# Altium project SDR_cubesat.PrjPcb (part 2 of 2)

## Sheet burnwire.SchDoc
size A; SheetNumber: 8; SheetTotal: 10
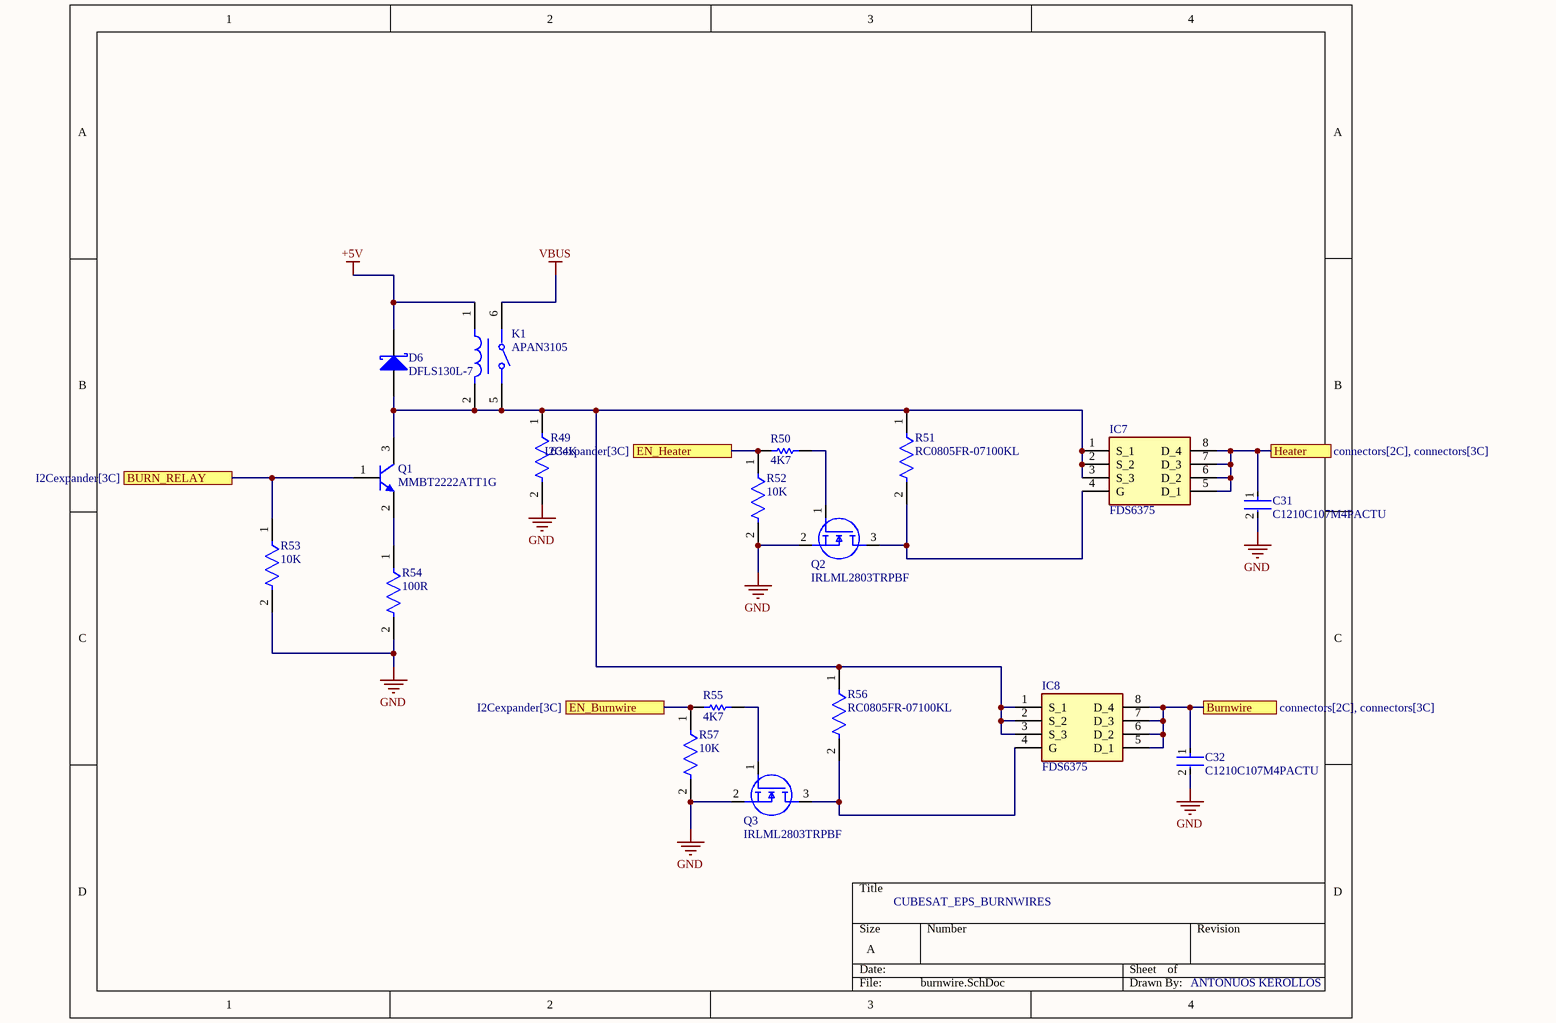
[diagram p7: burnwire.SchDoc]

### Parts
C31  C1210C107M4PACTU  [FP-C1210C-FS-MFG]
C32  C1210C107M4PACTU  [FP-C1210C-FS-MFG]
D6  DFLS130L-7  [DIOD-POWERDI123-2_A_V]
IC7  FDS6375  [SOIC127P600X175-8N]
IC8  FDS6375  [SOIC127P600X175-8N]
K1  APAN3105  [FP-APAN3105-MFG]
Q1  MMBT2222ATT1G  [ONSC-SC-75-3-463-01_V]
Q2  IRLML2803TRPBF  [SOT95P237X112-3N]
Q3  IRLML2803TRPBF  [SOT95P237X112-3N]
R49  634K  [FP-CRCW0805-e3-IPC_A]
R50  4K7  [YAGO-RC0805_M]
R51  RC0805FR-07100KL  [FP-RC0805-0_6-IPC_C]
R52  10K  [FP-CRCW0805-e3-IPC_A]
R53  10K  [FP-CRCW0805-e3-IPC_A]
R54  100R  [FP-RC0603-0_55-MFG]
R55  4K7  [YAGO-RC0805_M]
R56  RC0805FR-07100KL  [FP-RC0805-0_6-IPC_C]
R57  10K  [FP-CRCW0805-e3-IPC_A]

### Ports
BURN_RELAY (see I2Cexpander[3C]), Burnwire (see connectors[2C], connectors[3C]), EN_Burnwire (see I2Cexpander[3C]), EN_Heater (see I2Cexpander[3C]), Heater (see connectors[2C], connectors[3C])

### Nets
+5V: D6.2(K) K1.1
GND: C31.2 C32.2 Q2.2(S) Q3.2(S) R49.2 R52.2 R53.2 R54.2 R57.2
VBUS: K1.6(COM)
NetC31_1: C31.1 IC7.5(D_1) IC7.6(D_2) IC7.7(D_3) IC7.8(D_4) ; port Heater
NetC32_1: C32.1 IC8.5(D_1) IC8.6(D_2) IC8.7(D_3) IC8.8(D_4) ; port Burnwire
NetD6_1: D6.1(A) IC7.1(S_1) IC7.2(S_2) IC7.3(S_3) IC8.1(S_1) IC8.2(S_2) IC8.3(S_3) K1.2 K1.5(NO) Q1.3(C) R49.1 R51.1 R56.1
NetIC2_7: Q1.1(B) R53.1 ; port BURN_RELAY
NetIC2_8: R50.1 R52.1 ; port EN_Heater
NetIC2_10: R55.1 R57.1 ; port EN_Burnwire
NetIC7_4: IC7.4(G) Q2.3(D) R51.2
NetIC8_4: IC8.4(G) Q3.3(D) R56.2
NetQ1_2: Q1.2(E) R54.1
NetQ2_1: Q2.1(G) R50.2
NetQ3_1: Q3.1(G) R55.2

### Notes on the sheet
- CUBESAT_EPS_BURNWIRES
- ANTONUOS KEROLLOS

### Library data of the parts
C31 C32 = CMP-03020-034653-1: CAP CER 100UF 16V X5R 1210; Tolerance: 20%; Dielectric Material: Ceramic; Max Operating Temperature: 85°C; REACH SVHC: No SVHC; Case Code (Metric): 3225; Case/Package: 1210; Thickness: 0.106inch; Length: 3.2mm; Min Operating Temperature: -55°C; Voltage Rating (DC): 16V; Weight: 0.000564oz; Packaging: Tape and Reel; Case Code (Imperial): 1210; Depth: 2.5mm; Lead Free: Lead Free; Width: 0.098inch; Voltage Rating: 16V; Capacitance: 100uF; Termination: SMD/SMT; Dielectric: X5R; Package Quantity: 1000
D6 = CMP-2000-07448-1: Schottky Barrier Rectifier, 30 V, 1 A, -40 to 125 degC, 2-Pin SMD, RoHS, Tape and Reel; Manufacturer: Diodes Inc; Max Repetitive Reverse Voltage (Vrrm): 30V; Polarity: Standard; Average Rectified Current: 1A; Element Configuration: Single; Forward Voltage: 360mV; Peak Non-Repetitive Surge Current: 50A; Max Power Dissipation: 1.67W; Case\/Package: SMD/SMT; Capacitance: 76pF; Peak Reverse Current: 1mA; Datasheet URL: https://www.diodes.com/assets/Datasheets/ds30492.pdf; Package Quantity: 3000; Reverse Voltage (DC): 30V; Package Reference: POWERDI123-2_A; Lead Free: LeadFree; Mounting Technology: SurfaceMount; Max Operating Temperature: 125degC; Current Rating: 1A; Radiation Hardening: No; Width: 1.78mm; Height: 0.98mm; Output Current: 1A; Contact Plating: Matte; Length: 2.8mm; Number of Pins: 2; Voltage Rating (DC): 30V; RoHSCompliant: true; Termination: SMD/SMT; Forward Current: 1A; Min Operating Temperature: -40degC; Datasheet Version: Rev. 4-2, 06/2009; Packaging: TapeandReel; REACH SVHC: NoSVHC; Max Forward Surge Current (Ifsm): 50A; Manufacturer URL: http://www.diodes.com/; Mount: SurfaceMount; Package Description: 2-Pin Small Outline Diode, Body 2.8 x 1.78 mm
IC7 IC8 = FDS6375: Integrated Circuit; Manufacturer_Name: onsemi; Datasheet Link: https://www.onsemi.com/pub/Collateral/FDS6375-D.pdf; Height: 1.75mm; Manufacturer_Part_Number: FDS6375; Mouser Part Number: 512-FDS6375; Mouser Price/Stock: https://www.mouser.co.uk/ProductDetail/onsemi-Fairchild/FDS6375?qs=HK%252BeIG1iaag0XY66%2FG8lnA%3D%3D; Arrow Part Number: FDS6375; Arrow Price/Stock: https://www.arrow.com/en/products/fds6375/on-semiconductor
K1 = CMP-05606-000084-1: RELAY GENERAL PURPOSE SPST 5A 5V; Coil Power: 110mW; Coil Type: Non-Latching; Coil Resistance: 227R; Coil Current: 22mA; Release Time: 5ms; Operate Time: 10ms; Contact Material: Gold; Termination: PC Pin; Contact Current Rating: 5A; Throw Configuration: SPST; Package Quantity: 25; Coil Voltage (DC): 5V; Lead Free: Lead Free; Mount: Through Hole; Min Operating Temperature: -40°C; Max Operating Temperature: 90°C; Packaging: Rail/Tube; RoHS Compliant: Yes; Relay Type: General Purpose
Q1 = CMP-1048-00417-1: General Purpose Transistor, NPN Silicon, 3-Pin SC-75, Pb-Free, Tape and Reel; Manufacturer: On Semiconductor; IC Continuous (A): 0.6; fT Min (MHz): 300; DatasheetVersion: Rev. 5; PackageVersion: Rev. F, 07/2005; ComponentLink1Description: Manufacturer URL; RoHS: TRUE; Packing: Tape and Reel; ComponentLink3URL: http://www.onsemi.com/pub_link/Collateral/463-01.PDF; ComponentLink1URL: http://www.onsemi.com/; ComponentLink3Description: Package Specification; ComponentLink2URL: http://www.onsemi.cn/pub_link/Collateral/MMBT2222ATT1-D.PDF; Mounting Technology: Surface Mount; PartNumber: MMBT2222ATT1G; ComponentLink2Description: Datasheet; Polarity: NPN; PackageReference: SC-75-3-463-01; PackageDescription: 3-Pin Small Outline Transistor, Body 1.6 x 0.8 mm, Pitch 0.5 mm
Q2 Q3 = IRLML2803TRPBF: MOSFET (N-Channel); Manufacturer_Name: Infineon; Datasheet Link: https://www.infineon.com/dgdl/irlml2803pbf.pdf?fileId=5546d462533600a4015356682aff260f; Height: 1.12mm; Manufacturer_Part_Number: IRLML2803TRPBF; Mouser Part Number: 942-IRLML2803TRPBF; Mouser Price/Stock: https://www.mouser.co.uk/ProductDetail/Infineon-Technologies/IRLML2803TRPBF?qs=9%252BKlkBgLFf2YYGlrpx3%252BKw%3D%3D; Arrow Part Number: IRLML2803TRPBF; Arrow Price/Stock: https://www.arrow.com/en/products/irlml2803trpbf/infineon-technologies-ag?utm_currency=USD&region=nac
R49 = CMP-1013-00827-2: RES Thick Film, 634kΩ, 1%, 0.125W, 100ppm/°C, 0805; Voltage Rating: 150V; Max Power Dissipation: 125mW; Resistance: 634kR; Weight: 0.000194oz; Max Operating Temperature: 155°C; Case Code (Metric): 2012; Height: 0.02inch; Temperature Coefficient: 100ppm/°C; Power Rating: 125mW; Length: 2mm; Contact Plating: Tin; Package Quantity: 10; Packaging: Tape and Reel; Min Operating Temperature: -55°C; Case Code (Imperial): 0805; Termination: SMD/SMT; Composition: Thick Film; Case/Package: 0805; Lead Free: Lead Free; Voltage Rating (DC): 150V; Width: 0.049inch; Features: Automotive AEC-Q200; Tolerance: 1%; Radiation Hardening: No; Depth: 1.25mm; Military Standard: Not; Number of Terminations: 2
R50 R55 = CMP-1568-00001-1: General Puprose Chip Resistor, 4700 Ohm +/- 1%, 0.125 W, -55 to 155 degC, 2-Pin SMD, RoHS, Tape and Reel; PartNumber: RC0805FR-074K7L; Tolerance: +/- 1%; Power: 0.125 W; PackageDescription: 2-Pin Surface Mount Device, Body 2 x 1.25 mm; ComponentLink2URL: http://www.yageo.com/documents/recent/PYu-RC_Group_51_RoHS_L-3.pdf; Temperature Min: -55 degC; Packing: Tape and Reel; Mounting Technology: Surface Mount; ComponentLink1URL: http://www.yageo.com/NewPortal/_en/index.jsp; Resistance: 4700 Ohm; Temperature Max: 155 degC; ComponentLink2Description: Datasheet; DatasheetVersion: Rev. 3; RoHS: TRUE; ComponentLink1Description: Manufacturer URL
R51 R56 = CMP-2100-03668-5: RES 100K OHM 1% 1/8W 0805; Power Rating: 125mW; Temperature Coefficient: 100ppm/°C; Voltage Rating (DC): 150V; Resistance: 100kR; Package Quantity: 1; Case/Package: 0805; Lead Pitch: 0.4mm; Case Code (Imperial): 0805; Construction: Rectangular; Number of Terminations: 2; RoHS Compliant: Yes; Max Power Dissipation: 125mW; Tolerance: 1%; Max Operating Temperature: 155°C; Resistance Tolerance: 1%; Lead Free: Lead Free; Packaging: Tape and Reel; Resistor Type: Thick Film; Min Operating Temperature: -55°C; Case Code (Metric): 2012; Series: RC; Technology: THICK FILM; Voltage Rating: 150V; Termination: SMD/SMT; Width: 0.049inch; Number of Pins: 2; Features: Moisture Resistant; Military Standard: Not; Length: 0.079inch; Depth: 1.25mm; Size Code: 0805; Height: 0.024inch
R52 R53 R57 = CMP-2001-04908-2: RES Thick Film, 10kΩ, 1%, 0.125W, 100ppm/°C, 0805; Resistance: 10kR; Voltage Rating (DC): 150V; Power Rating: 125mW; Weight: 0.000194oz; Package Quantity: 5000; Military Standard: Not; Max Operating Temperature: 155°C; Temperature Coefficient: 100ppm/°C; Contact Plating: Tin; Width: 1.25mm; Height: 0.45mm; Radiation Hardening: No; Tolerance: 1%; Min Operating Temperature: -55°C; Voltage Rating: 150V; Length: 2mm; Depth: 1.25mm; Termination: SMD/SMT; Packaging: Tape and Reel; Case/Package: 0805; Case Code (Metric): 2012; Lead Free: Lead Free; Case Code (Imperial): 0805; Composition: Thick Film
R54 = CMP-2100-03663-2: NexarPartId: 55402879; Voltage Rating: 50V; Power Rating: 100mW; Tolerance: 1%; Temperature Coefficient: 100ppm/°C; Resistance: 100Ω; Case/Package: 0603; Military Standard: Not; REACH SVHC: Unknown; Case Code (Metric): 0603; Max Operating Temperature: 155°C; Schedule B: 8533210045, 8533210045; Height: 450µm; Length: 1.6mm; Lead Free: Lead Free; Packaging: Tape & Reel; Case Code (Imperial): 0603; Composition: Thick Film; Min Operating Temperature: -55°C; Voltage Rating (DC): 50V; RoHS: Compliant; Depth: 800µm; Number of Pins: 2; Termination: SMD/SMT; Width: 800µm

## Sheet SolarConnectors.SchDoc
size A; SheetNumber: 9; SheetTotal: 10
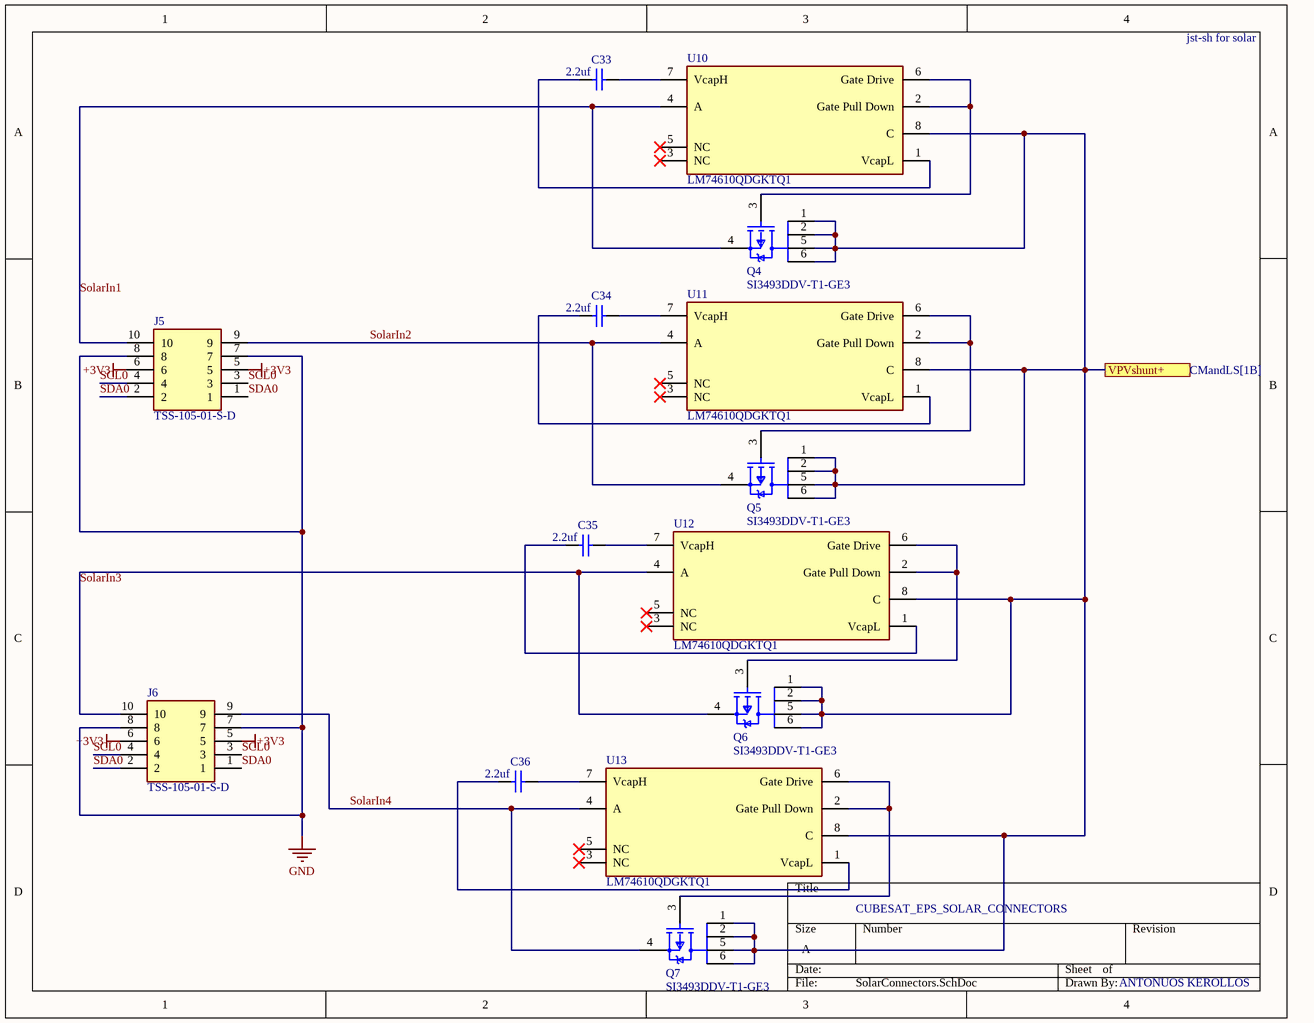
[diagram p8: SolarConnectors.SchDoc]

### Parts
C33  2.2uf  [CAPC2013X145X50ML20T25]
C34  2.2uf  [CAPC2013X145X50ML20T25]
C35  2.2uf  [CAPC2013X145X50ML20T25]
C36  2.2uf  [CAPC2013X145X50ML20T25]
J5  TSS-105-01-S-D  [TSS-105-XX-YYY-D]
J6  TSS-105-01-S-D  [TSS-105-XX-YYY-D]
Q4  SI3493DDV-T1-GE3  [FP-C-06593-MFG]
Q5  SI3493DDV-T1-GE3  [FP-C-06593-MFG]
Q6  SI3493DDV-T1-GE3  [FP-C-06593-MFG]
Q7  SI3493DDV-T1-GE3  [FP-C-06593-MFG]
U10  LM74610QDGKTQ1  [FP-DGK0008A-MFG]
U11  LM74610QDGKTQ1  [FP-DGK0008A-MFG]
U12  LM74610QDGKTQ1  [FP-DGK0008A-MFG]
U13  LM74610QDGKTQ1  [FP-DGK0008A-MFG]

### Ports
VPVshunt+ (see CMandLS[1B])

### Nets
+3V3: J5.5 J5.6 J6.5 J6.6
GND: J5.7 J5.8 J6.7 J6.8
SCL0: J5.3 J5.4 J6.3 J6.4
SDA0: J5.1 J5.2 J6.1 J6.2
SolarIn1: J5.10 Q4.4(S) U10.4(A)
SolarIn2: J5.9 Q5.4(S) U11.4(A)
SolarIn3: J6.10 Q6.4(S) U12.4(A)
SolarIn4: J6.9 Q7.4(S) U13.4(A)
NetC33_1: C33.1 U10.7(VcapH)
NetC33_2: C33.2 U10.1(VcapL)
NetC34_1: C34.1 U11.7(VcapH)
NetC34_2: C34.2 U11.1(VcapL)
NetC35_1: C35.1 U12.7(VcapH)
NetC35_2: C35.2 U12.1(VcapL)
NetC36_1: C36.1 U13.7(VcapH)
NetC36_2: C36.2 U13.1(VcapL)
NetQ4_1: Q4.1(D) Q4.2(D) Q4.5(D) Q4.6(D) Q5.1(D) Q5.2(D) Q5.5(D) Q5.6(D) Q6.1(D) Q6.2(D) Q6.5(D) Q6.6(D) Q7.1(D) Q7.2(D) Q7.5(D) Q7.6(D) U10.8(C) U11.8(C) U12.8(C) U13.8(C) ; port VPVshunt+
NetQ4_3: Q4.3(G) U10.2(Gate_Pull_Down) U10.6(Gate_Drive)
NetQ5_3: Q5.3(G) U11.2(Gate_Pull_Down) U11.6(Gate_Drive)
NetQ6_3: Q6.3(G) U12.2(Gate_Pull_Down) U12.6(Gate_Drive)
NetQ7_3: Q7.3(G) U13.2(Gate_Pull_Down) U13.6(Gate_Drive)

Not connected (* = marked no-connect by the designer): U10 3(NC)* 5(NC)*; U11 3(NC)* 5(NC)*; U12 3(NC)* 5(NC)*; U13 3(NC)* 5(NC)*

### Notes on the sheet
- jst-sh for solar
- (near U13) CUBESAT_EPS_SOLAR_CONNECTORS
- ANTONUOS KEROLLOS

### Library data of the parts
C33-C36 = CMP-1036-04819-2: Part Number: C0805C225K9PACTU; Manufacturer: Kemet
J5 J6 = TSS-105-01-S-D: Connector; Manufacturer_Name: SAMTEC; Datasheet Link: http://suddendocs.samtec.com/prints/tss-1xx-xx-xxx-x-xx-xx-mkt.pdf; Manufacturer_Part_Number: TSS-105-01-S-D; Mouser Part Number: 200-TSS10501SD; Mouser Price/Stock: https://www.mouser.com/Search/Refine.aspx?Keyword=200-TSS10501SD; Arrow Part Number: TSS-105-01-S-D; Arrow Price/Stock: https://www.arrow.com/en/products/tss-105-01-s-d/samtec
Q4-Q7 = CMP-02550-000156-1: MOSFET P-CHANNEL 20V 8A 6TSOP; Manufacturer: Vishay; Rthja Max: 62.5°C/W; Number Of Channels: 1; Reverse Recovery Time: 21ns; Max Forward Diode Voltage: -1.2V; Threshold Vgs Min: -0.4V; Turn Off Delay Time: 95ns; Input Capacitace At Vds: 1825pF @ -10V; Typ Forward Diode Voltage: -0.8V; Threshold Vgs Max: -1V; Continuous Drain Current: -7.5A; Gate Charge At Vgs: 34.8nC @ -8V; Depletion Mode: False; Drain To Source Breakdown Voltage: -20V; Pulse Drain Current: -32A; Reverse Recovery Charge: 34.8nC; Transconductance: 30S; Max Junction Temp: +150°C; Standoff Height: 0.01mm; Drain To Source Resistance: 0.02Ω; Power Dissipation: 2W; Turn On Delay Time: 25ns; Gate To Source Voltage: 8V; Device Class L2: Transistors; Footprint Url: https://www.vishay.com/docs/71200/71200.pdf; Category: Trans; Automotive: No; Digikey Description: MOSFET P-CHANNEL 20V 8A 6TSOP; Manufacturer Part Number: SI3493DDV-T1-GE3; Lead Free: Yes; Octopart: https://octopart.com/si3493ddv-t1-ge3-vishay-81014282; Temperature: -55°C to +150°C; ComponentLink2Description: Datasheet; Device Class L1: Discrete Semiconductors; Temperature Range High: +150°C; RoHS: TRUE; Number Of P Channels: 1; Device Class L3: MOSFETs; Height: 1.1mm; Temperature Range Low: -55°C; Package: C-06593; ComponentLink2URL: https://www.vishay.com/docs/74735/si3493ddv.pdf; Drain To Source Voltage: -20V
U10-U13 = CMP-04910-000005-1: IC SMART DIODE CTLR 8VSSOP; Manufacturer: Texas Instruments; Number Of Outputs: 1; Max Supply Voltage: 42V; Nominal Supply Current: 0uA; Min Supply Voltage: 0.48V; Automotive Grade: Grade 1; Standoff Height: 0.05mm; RoHS: TRUE; Temperature: -40°C to +125°C; Digikey Description: IC SMART DIODE CTLR 8VSSOP; Package: DGK0008A; Automotive: Yes; Device Class L3: unset; Manufacturer Part Number: LM74610QDGKTQ1; Category: IC; Device Class L1: Integrated Circuits (ICs); ComponentLink2URL: http://www.ti.com/lit/ds/symlink/lm74610-q1.pdf; ComponentLink2Description: Datasheet; Temperature Range Low: -40°C; Temperature Range High: +125°C; Device Class L2: Power Management ICs; Octopart: https://octopart.com/lm74610qdgktq1-texas+instruments-61765970; Ambient Temperature Range High: +125°C; Height: 1.1mm; Lead Free: Yes; Ambient Temperature Range Low: -40°C

## Sheet connectors.SchDoc
size A; SheetNumber: 10; SheetTotal: 10
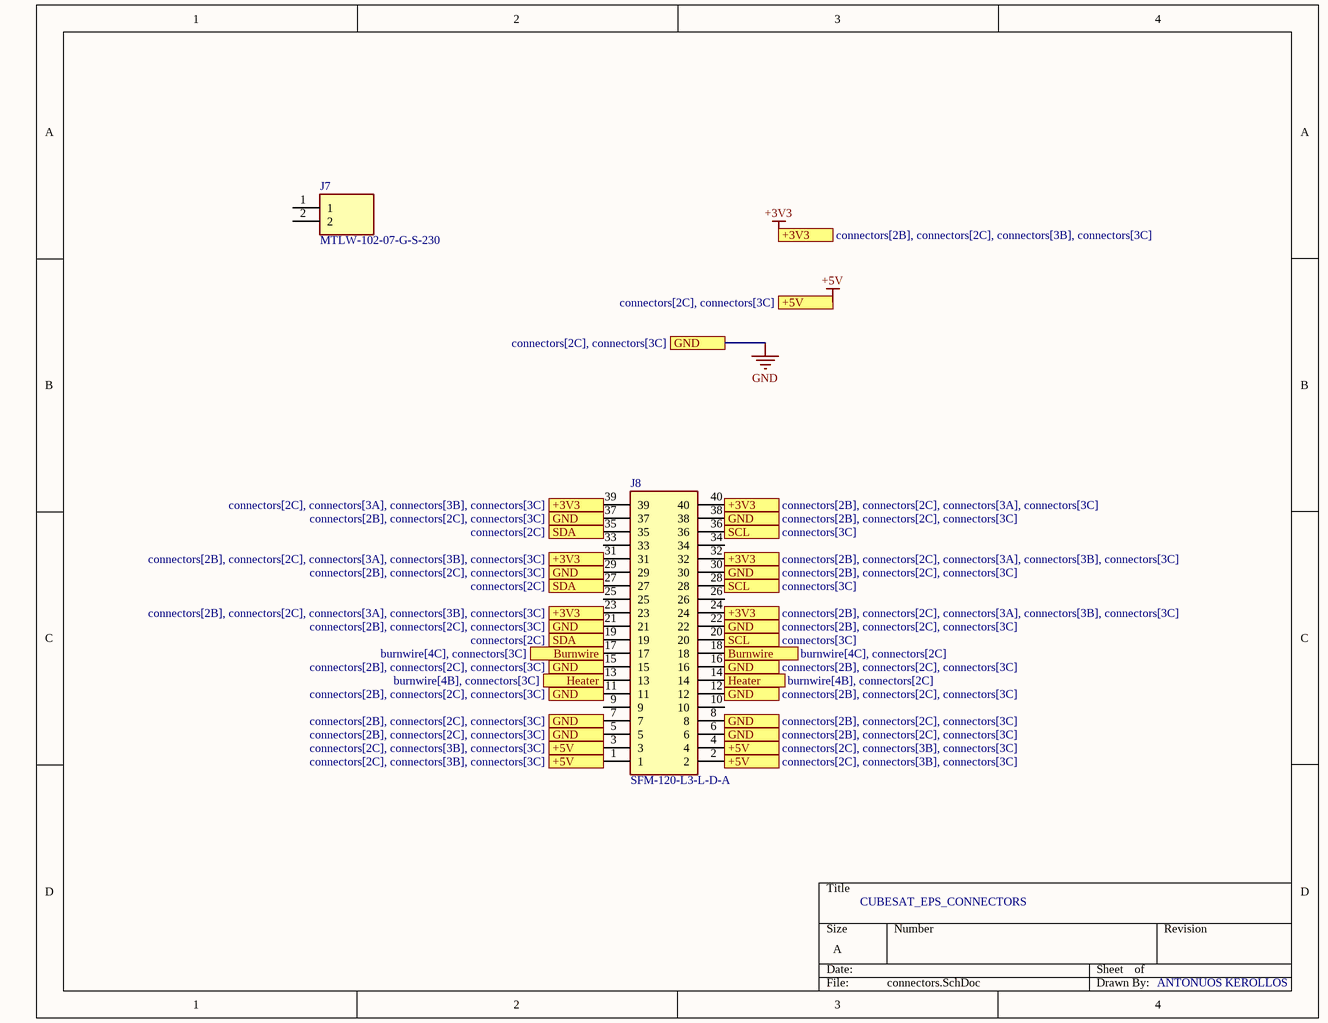
[diagram p9: connectors.SchDoc]

### Parts
J7  MTLW-102-07-G-S-230  [HDRV2W82P0X254_1X2_508X249X876P]
J8  SFM-120-L3-L-D-A  [SFM-120-YY-XX-D-A]

### Ports
+3V3 (see connectors[2B], connectors[2C], connectors[3A], connectors[3B], connectors[3C]), +3V3 (see connectors[2B], connectors[2C], connectors[3A], connectors[3C]), +3V3 (see connectors[2B], connectors[2C], connectors[3B], connectors[3C]), +3V3 (see connectors[2C], connectors[3A], connectors[3B], connectors[3C]), +5V (see connectors[2C], connectors[3B], connectors[3C]), +5V (see connectors[2C], connectors[3C]), Burnwire (see burnwire[4C], connectors[2C]), Burnwire (see burnwire[4C], connectors[3C]), GND (see connectors[2B], connectors[2C], connectors[3C]), GND (see connectors[2C], connectors[3C]), Heater (see burnwire[4B], connectors[2C]), Heater (see burnwire[4B], connectors[3C]), SCL (see connectors[3C]), SDA (see connectors[2C])

### Nets
+3V3: J8.23 J8.24 J8.31 J8.32 J8.39 J8.40 ; port +3V3
+5V: J8.1 J8.2 J8.3 J8.4 ; port +5V
GND: J8.5 J8.6 J8.7 J8.8 J8.11 J8.12 J8.15 J8.16 J8.21 J8.22 J8.29 J8.30 J8.37 J8.38 ; port GND
NetC31_1: J8.13 J8.14 ; port Heater
NetC32_1: J8.17 J8.18 ; port Burnwire
NetJ8_19: J8.19 J8.27 J8.35 ; port SDA
NetJ8_20: J8.20 J8.28 J8.36 ; port SCL

Not connected (* = marked no-connect by the designer): J7 1 2; J8 9 10 25 26 33 34

### Notes on the sheet
- CUBESAT_EPS_CONNECTORS
- ANTONUOS KEROLLOS

### Library data of the parts
J7 = MTLW-102-07-G-S-230: Connector; Manufacturer_Name: SAMTEC; Datasheet Link: https://componentsearchengine.com/Datasheets/1/MTLW-102-07-G-S-230.pdf; Height: 8.76mm; Manufacturer_Part_Number: MTLW-102-07-G-S-230; Mouser Part Number: 200-MTLW10207GS230; Mouser Price/Stock: https://www.mouser.com/Search/Refine.aspx?Keyword=200-MTLW10207GS230; Arrow Part Number: MTLW-102-07-G-S-230; Arrow Price/Stock: https://www.arrow.com/en/products/mtlw-102-07-g-s-230/samtec
J8 = SFM-120-L3-L-D-A: Connector; Manufacturer_Name: SAMTEC; Datasheet Link: http://suddendocs.samtec.com/prints/sfm-1xx-xx-xxx-d-xxx-mkt.pdf; Manufacturer_Part_Number: SFM-120-L3-L-D-A

## Nets that join several sheets
+3V3: ORingSW (IC.6), I2Cexpander (14 pins), CMandLS (19 pins), SolarConnectors (J5.5 J5.6 J6.5 J6.6), connectors (6 pins)
+5V: REG5V (C10.1 C11.1 R12.1 U4.6), battery (C17.1 IC3.10), CMandLS (5 pins), burnwire (D6.2 K1.1), connectors (J8.1 J8.2 J8.3 J8.4)
BatCell2Chargershunt+: battery (C16.1 IC3.1), CMandLS (R41.1 U8.1)
BatCell2Chargershunt-: ORingSW (U5.1-2), CMandLS (R41.2 U8.2)
GND: MPPTcharger (7 pins), REG3V3 (6 pins), REG5V (5 pins), ORingSW (7 pins), I2Cexpander (8 pins), battery (11 pins), CMandLS (27 pins), burnwire (9 pins), SolarConnectors (J5.7 J5.8 J6.7 J6.8), connectors (14 pins)
PV power: MPPTcharger (5 pins), ORingSW (C12.1 R14.1), CMandLS (R34.2 U7.2)
VBUS: REG3V3 (6 pins), REG5V (C9.1 L3.1 U4.2 U4.3), burnwire (K1.6)
NetC3_1: MPPTcharger (5 pins), CMandLS (R48.1 U9.1)
NetC31_1: burnwire (5 pins), connectors (J8.13 J8.14)
NetC32_1: burnwire (5 pins), connectors (J8.17 J8.18)
NetIC1_1: I2Cexpander (IC1.1), CMandLS (R29.1)
NetIC1_2: I2Cexpander (IC1.2), CMandLS (R30.1)
NetIC1_3: I2Cexpander (IC1.3), CMandLS (R31.1)
NetIC1_4: I2Cexpander (IC1.4), CMandLS (R32.1)
NetIC1_5: I2Cexpander (IC1.5), CMandLS (R36.1)
NetIC1_6: I2Cexpander (IC1.6), CMandLS (R37.1)
NetIC1_7: I2Cexpander (IC1.7), CMandLS (R39.1)
NetIC1_8: I2Cexpander (IC1.8), CMandLS (R38.1)
NetIC1_14: I2Cexpander (IC1.14), CMandLS (R43.1)
NetIC1_15: I2Cexpander (IC1.15), CMandLS (R44.1)
NetIC1_16: I2Cexpander (IC1.16), CMandLS (R45.1)
NetIC1_17: I2Cexpander (IC1.17), CMandLS (R46.1)
NetIC1_19: I2Cexpander (IC1.19 IC2.19 R21.1 R25.1), CMandLS (U7.5 U8.5 U9.5)
NetIC1_20: I2Cexpander (IC1.20 IC2.20 R20.1 R24.1), CMandLS (U7.6 U8.6 U9.6)
NetIC2_1: MPPTcharger (U1.4), I2Cexpander (IC2.1)
NetIC2_2: MPPTcharger (U1.5), I2Cexpander (IC2.2)
NetIC2_4: I2Cexpander (IC2.4), battery (IC3.9)
NetIC2_5: I2Cexpander (IC2.5), battery (IC3.3)
NetIC2_7: I2Cexpander (IC2.7), burnwire (Q1.1 R53.1)
NetIC2_8: I2Cexpander (IC2.8), burnwire (R50.1 R52.1)
NetIC2_10: I2Cexpander (IC2.10), burnwire (R55.1 R57.1)
NetIC2_13: ORingSW (U5.14), I2Cexpander (IC2.13)
NetIC2_14: ORingSW (U5.13), I2Cexpander (IC2.14)
NetIC2_15: ORingSW (U5.11), I2Cexpander (IC2.15)
NetIC2_16: ORingSW (U5.12), I2Cexpander (IC2.16)
NetIC_1: ORingSW (IC.1 U5.3 U5.6), battery (IC3.4)
NetQ4_1: CMandLS (R34.1 U7.1), SolarConnectors (20 pins)
NetR48_2: ORingSW (U5.7-8), CMandLS (R48.2 U9.2)